# Altium project UART-RS232-RS485.PrjPCB
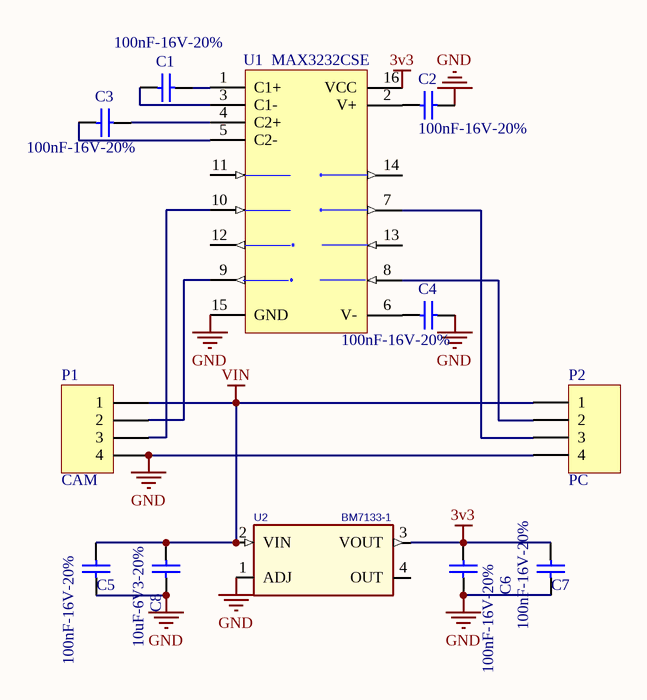
[diagram p0: Sheet1.SchDoc]
1 sheet, 12 parts. Net scope: global (net labels, ports and power ports of the same name join across sheets).
Board file: PCB1.PcbDoc

## Sheet Sheet1.SchDoc
size A

### Parts
C1  100nF-16V-20%  [C0603]
C2  100nF-16V-20%  [C0603]
C3  100nF-16V-20%  [C0603]
C4  100nF-16V-20%  [C0603]
C5  100nF-16V-20%  [C0603]
C6  100nF-16V-20%  [C0603]
C7  100nF-16V-20%  [C0603]
C8  10uF-6V3-20%  [C0603]
P1  CAM  [Header-2mm-4pin]
P2  PC  [Header-2mm-4pin]
U1  MAX3232CSE  [SO16-150mil]
U2  BM7133-1  [SOT_89]

### Nets
3v3: C6.2 C7.1 U1.16(VCC) U2.3(VOUT)
GND: C2.2 C4.2 C5.2 C6.1 C7.2 C8.1 P1.4 P2.4 U1.15(GND) U2.1(ADJ)
VIN: C5.1 C8.2 P1.1 P2.1 U2.2(VIN)
NetC1_1: C1.1 U1.3(C1-)
NetC1_2: C1.2 U1.1(C1+)
NetC2_1: C2.1 U1.2(V+)
NetC3_1: C3.1 U1.5(C2-)
NetC3_2: C3.2 U1.4(C2+)
NetC4_1: C4.1 U1.6(V-)
NetP1_2: P1.2 U1.9(R2OUT)
NetP1_3: P1.3 U1.10(T2IN)
NetP2_2: P2.2 U1.8(R2IN)
NetP2_3: P2.3 U1.7(T2OUT)

Not connected (* = marked no-connect by the designer): U1 11(T1IN) 12(R1OUT) 13(R1IN) 14(T1OUT); U2 4(OUT)

### Library data of the parts
C1-C7 = Cap: CAP CER 0.1UF 16V Y5V 0603; Manufacturer: Yageo; Manufacturer Part Number: CC0603ZRY5V7BB104; Published: 8-Jun-2000; LatestRevisionDate: 17-Jul-2002; LatestRevisionNote: Re-released for DXP Platform.; PackageReference: C0603; Publisher: Altium Limited; Value: 100nF-16V-20%; Digi-Key Part Number: 311-1369-1-ND; Unit Price: 0.00648
C8 = Cap: CAP CER 10UF 6.3V 20% X5R 0603; Manufacturer: Yageo; Manufacturer Part Number: CC0603MRX5R5BB106; Published: 8-Jun-2000; LatestRevisionDate: 17-Jul-2002; LatestRevisionNote: Re-released for DXP Platform.; PackageReference: C0603; Publisher: Altium Limited; Value: 10uF-6V3-20%; Digi-Key Part Number: 311-1448-1-ND; Unit Price: 0.06176
P1 P2 = MHDR1X4: Header, 4-Pin; LatestRevisionDate: 17-Jul-2002; LatestRevisionNote: Re-released for DXP Platform.; Publisher: Altium Limited
U1 = MAX3232CSE: 3.0V TO 5.5V, Low-Power, up to 1Mbps, True RS-232 Transceiver Using Four 0.1µF External Capacitor; Published: 16-Jan-2001; LatestRevisionDate: 13-Apr-2006; LatestRevisionNote: IPC-7351 Footprint Added.; DatasheetVersion: Mar-1999; PackageReference: NSO16; Publisher: Altium Limited; PackageDescription: 16-Pin Small Outline Integrated Circuit 1.27 mm Pitch; Code_JEDEC: MS-012-AC; Code_IPC: SOIC127P600-16; ComponentLink1Description: Manufacturer Link; ComponentLink1URL: http://www.maxim-ic.com/; ComponentLink2Description: Datasheet; ComponentLink2URL: http://pdfserv.maxim-ic.com/en/ds/MAX3222-MAX3241.pdf
U2 = LM117_0